# EAGLE design IO bottom board (EAGLE 9.6.2)
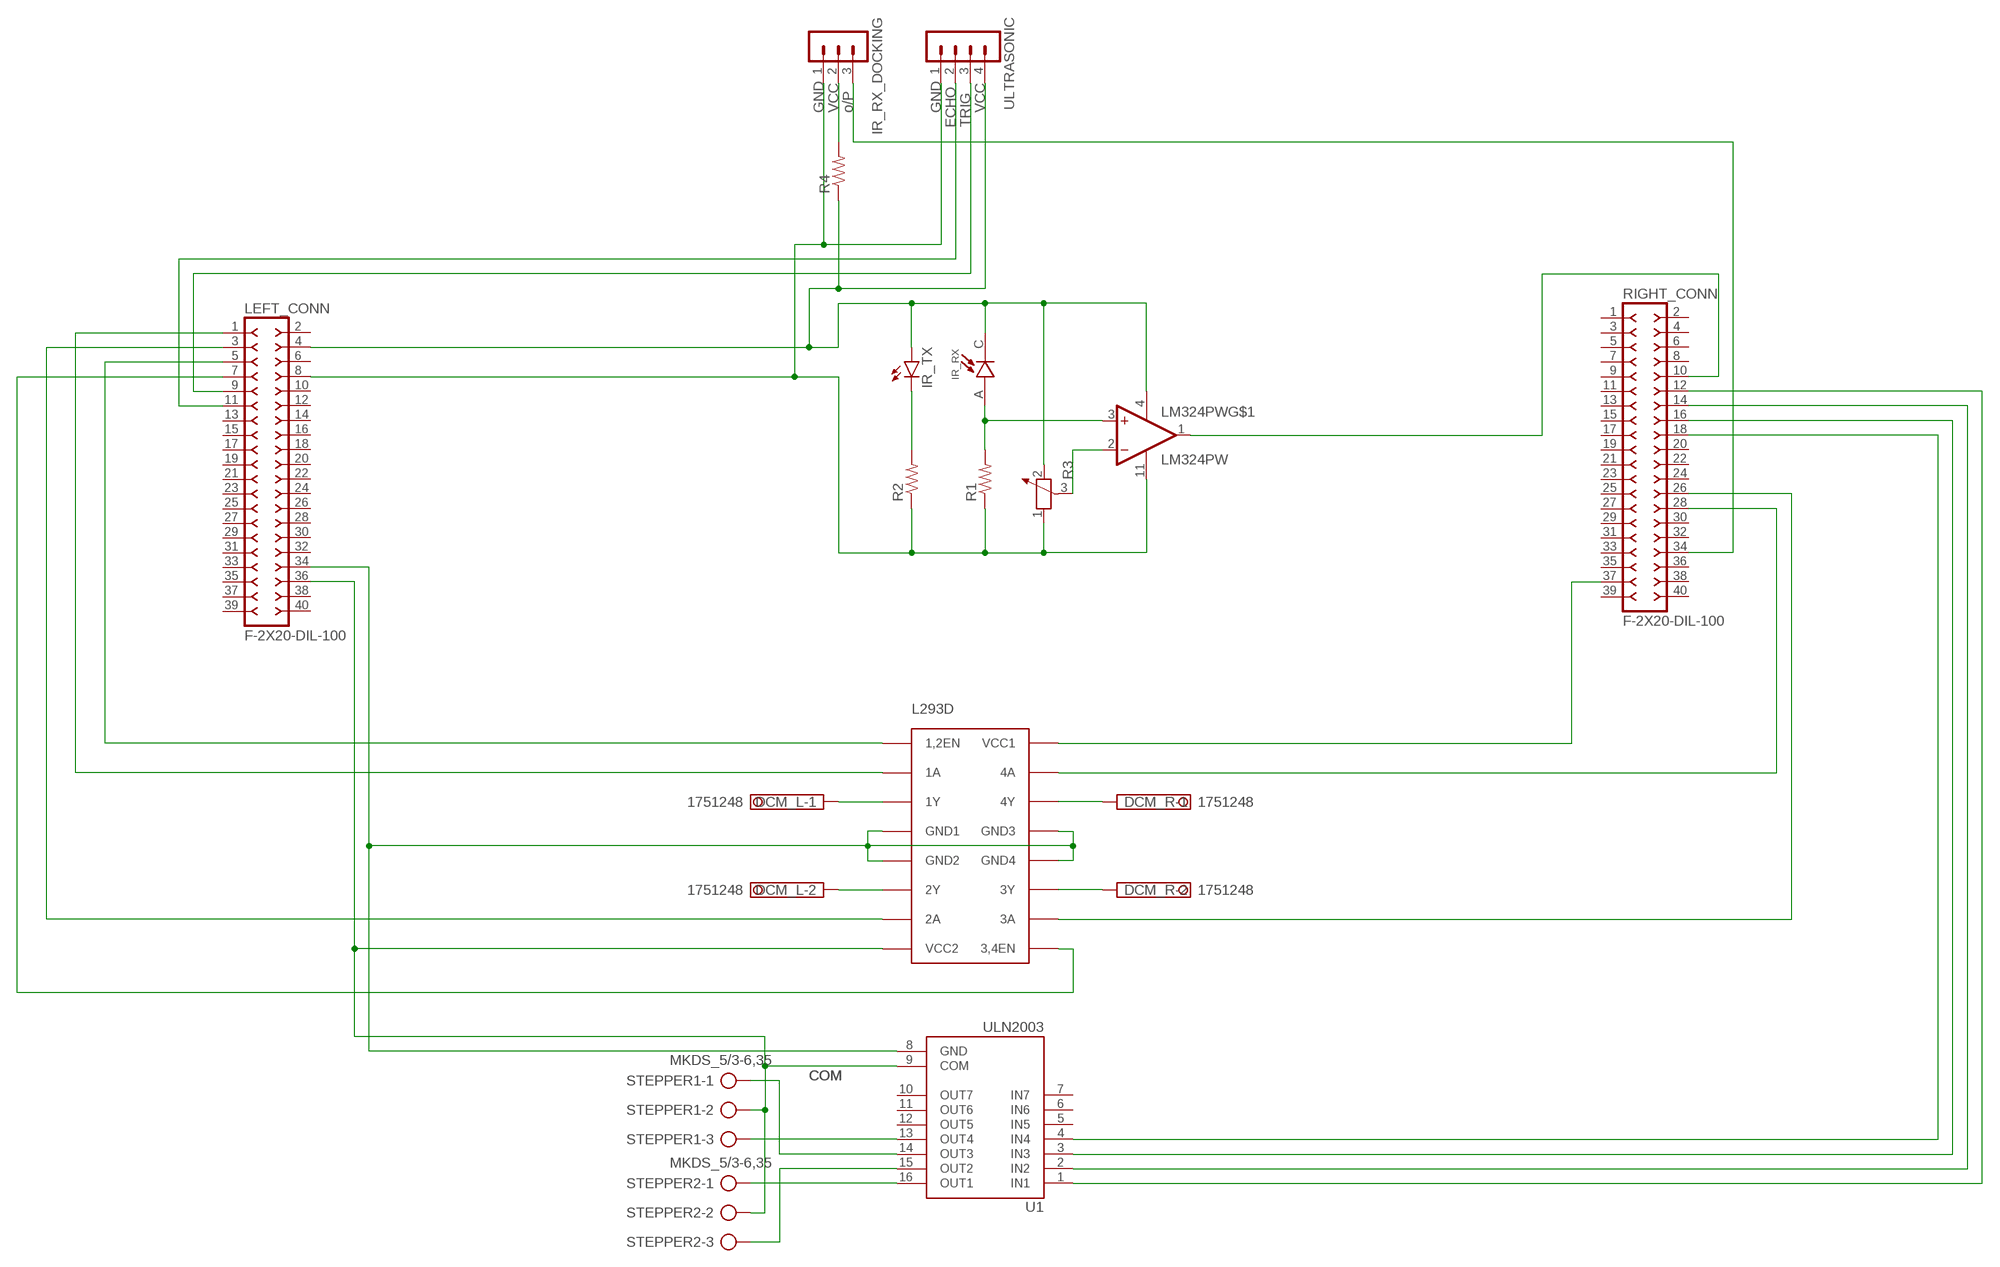
[diagram p0: schematic, sheet 1]

## Parts
DCM_L  1751248  [1751248]
DCM_R  1751248  [1751248]
IR_RX  BPV10  [XDCR_BPV10]
IR_RX_DOCKING  MA03-1  [MA03-1]
IR_TX  SFH482  [SFH482]
L293D  L293D  [DIL16]
LEFT_CONN  F-2X20-DIL-100  [DIL-100-2X20]
LM324PW  LM324PW  [SOP65P640X120-14N]
R1  R-US_0204/5  [0204/5]
R2  R-US_0204/5  [0204/5]
R3  POTENTIOMETER_PT-10  [PT-10]
R4  R-US_0204/5  [0204/5]
RIGHT_CONN  F-2X20-DIL-100  [DIL-100-2X20]
STEPPER1  MKDS_5/3-6,35  [MKDS_5/3-635]
STEPPER2  MKDS_5/3-6,35  [MKDS_5/3-635]
U1  ULN2003  [DIP762W46P254L1969H533Q16]
ULTRASONIC  MA04-1  [MA04-1]

## Nets
N$1: DCM_L.1 L293D.3(1Y)
N$2: DCM_L.2 L293D.6(2Y)
N$3: DCM_R.1 L293D.14(4Y)
N$4: DCM_R.2 L293D.11(3Y)
N$5: LEFT_CONN.11 ULTRASONIC.2
N$6: LEFT_CONN.9 ULTRASONIC.3
N$7: IR_RX_DOCKING.2 R4.2
N$8: L293D.16(VCC1) RIGHT_CONN.37
N$9: RIGHT_CONN.12 U1.1(IN1)
N$10: RIGHT_CONN.14 U1.2(IN2)
N$11: RIGHT_CONN.16 U1.3(IN3)
N$12: RIGHT_CONN.18 U1.4(IN4)
N$13: STEPPER2.1 U1.16(OUT1)
N$14: STEPPER2.3 U1.15(OUT2)
N$15: STEPPER1.1 U1.14(OUT3)
N$16: STEPPER1.3 U1.13(OUT4)
N$17: L293D.8(VCC2) LEFT_CONN.36 STEPPER1.2 STEPPER2.2 U1.9(COM)
N$18: LM324PW.1(OUT1) RIGHT_CONN.10
N$19: L293D.4(GND1) L293D.5(GND2) L293D.12(GND4) L293D.13(GND3) LEFT_CONN.34 U1.8(GND)
N$20: IR_RX.C IR_TX.A LEFT_CONN.4 LM324PW.4(VCC) R3.2 R4.1 ULTRASONIC.4
N$21: IR_TX.K(C) R2.2
N$23: IR_RX.A LM324PW.3(+IN1) R1.2
N$24: LM324PW.2(-IN1) R3.3
N$25: L293D.1(1,2EN) LEFT_CONN.5
N$26: L293D.9(3,4EN) LEFT_CONN.7
N$28: IR_RX_DOCKING.1 LEFT_CONN.8 LM324PW.11(GND) R1.1 R2.1 R3.1 ULTRASONIC.1
N$29: IR_RX_DOCKING.3 RIGHT_CONN.34
N$31: L293D.2(1A) LEFT_CONN.1
N$32: L293D.7(2A) LEFT_CONN.3
N$33: L293D.10(3A) RIGHT_CONN.26
N$34: L293D.15(4A) RIGHT_CONN.28
Unconnected: LEFT_CONN.2 LEFT_CONN.6 LEFT_CONN.10 LEFT_CONN.12 LEFT_CONN.13 LEFT_CONN.14 LEFT_CONN.15 LEFT_CONN.16 LEFT_CONN.17 LEFT_CONN.18 LEFT_CONN.19 LEFT_CONN.20 LEFT_CONN.21 LEFT_CONN.22 LEFT_CONN.23 LEFT_CONN.24 LEFT_CONN.25 LEFT_CONN.26 LEFT_CONN.27 LEFT_CONN.28 LEFT_CONN.29 LEFT_CONN.30 LEFT_CONN.31 LEFT_CONN.32 LEFT_CONN.33 LEFT_CONN.35 LEFT_CONN.37 LEFT_CONN.38 LEFT_CONN.39 LEFT_CONN.40 LM324PW.5(+IN2) LM324PW.6(-IN2) LM324PW.7(OUT2) LM324PW.8(OUT3) LM324PW.9(-IN3) LM324PW.10(+IN3) LM324PW.12(+IN4) LM324PW.13(-IN4) LM324PW.14(OUT4) RIGHT_CONN.1 RIGHT_CONN.2 RIGHT_CONN.3 RIGHT_CONN.4 RIGHT_CONN.5 RIGHT_CONN.6 RIGHT_CONN.7 RIGHT_CONN.8 RIGHT_CONN.9 RIGHT_CONN.11 RIGHT_CONN.13 RIGHT_CONN.15 RIGHT_CONN.17 RIGHT_CONN.19 RIGHT_CONN.20 RIGHT_CONN.21 RIGHT_CONN.22 RIGHT_CONN.23 RIGHT_CONN.24 RIGHT_CONN.25 RIGHT_CONN.27 RIGHT_CONN.29 RIGHT_CONN.30 RIGHT_CONN.31 RIGHT_CONN.32 RIGHT_CONN.33 RIGHT_CONN.35 RIGHT_CONN.36 RIGHT_CONN.38 RIGHT_CONN.39 RIGHT_CONN.40 U1.5(IN5) U1.6(IN6) U1.7(IN7) U1.10(OUT7) U1.11(OUT6) U1.12(OUT5)

## Notes on the sheet
- GND | VCC | o/P | GND | VCC
- ECHO | TRIG
- COM | COM

## Library data of the parts
DCM_L DCM_R = con-phoenix-350:1751248: MKDS 1/ 2-3,5 Printklemme Nennstrom: 10 A Bemessungsspannung: 160 V Raster: 3,5 mm Polzahl: 2 Montageart: Löten Anschlussart: Schraubanschluss Anschlussrichtung vom Leiter zur Platine: 0° Source: http://eshop.phoenixcontact.com .. 1751248.pdf; OC_FARNELL: unknown; OC_NEWARK: unknown
IR_RX = IR Rx BPV10:BPV10: Check prices <https://pricing.snapeda.com/search/part/BPV10/?ref=eda>; AVAILABILITY: Good; DESCRIPTION: Photodiode 940nm 40° Radial; MF: Vishay; MP: BPV10; PACKAGE: Radial Vishay; PRICE: None; PURCHASE-URL: https://pricing.snapeda.com/search/part/BPV10/?ref=eda
IR_RX_DOCKING = con-lstb:MA03-1: PIN HEADER; OC_FARNELL: unknown; OC_NEWARK: unknown
IR_TX = led:SFH482: IR LED infrared emitting diode, Infineon
L293D = L293D 1:L293D
LEFT_CONN RIGHT_CONN = con-headers-jp:F-2X20-: FEMALE HEADER
LM324PW = LM324PW:LM324PW: IC OPAMP LM324/TSSOP/LM324PW TEXAS INSTRUMENT RoHS TSSOP14 Check prices <https://pricing.snapeda.com/search/part/LM324PW/?ref=eda>; AVAILABILITY: Good; DESCRIPTION: 4-Channel industry standard operational amplifier 14-TSSOP 0 to 70; MF: Texas Instruments; MP: LM324PW; PACKAGE: TSSOP-14 Texas Instruments; PRICE: None; PURCHASE-URL: https://pricing.snapeda.com/search/part/LM324PW/?ref=eda
R1 R2 R4 = rcl:R-US_: RESISTOR, American symbol; SPICEPREFIX: R
R3 = rcl:POTENTIOMETER_: Potentiometer; SPICEMODEL: POT; SPICEPREFIX: X
STEPPER1 STEPPER2 = con-phoenix-mkds_5:MKDS_5/3-: MKDS 5/3-6,35 Source: PHOENIX CONTACT; MF: FARNELL; MPN: 1714968; OC_FARNELL: 3704695; OC_NEWARK: 71C4092
U1 = ULN2003:ULN2003: Seven Darlington array Check prices <https://pricing.snapeda.com/search/part/ULN2003/?ref=eda>; AVAILABILITY: Bad; DESCRIPTION: Bipolar (BJT) Transistor Array 7 NPN Darlington 50V 500mA Surface Mount 16-SO; MF: STMicroelectronics; MP: ULN2003; PACKAGE: DIP-16 Toshiba; PRICE: None
ULTRASONIC = con-lstb:MA04-1: PIN HEADER; OC_FARNELL: unknown; OC_NEWARK: unknown

## Board
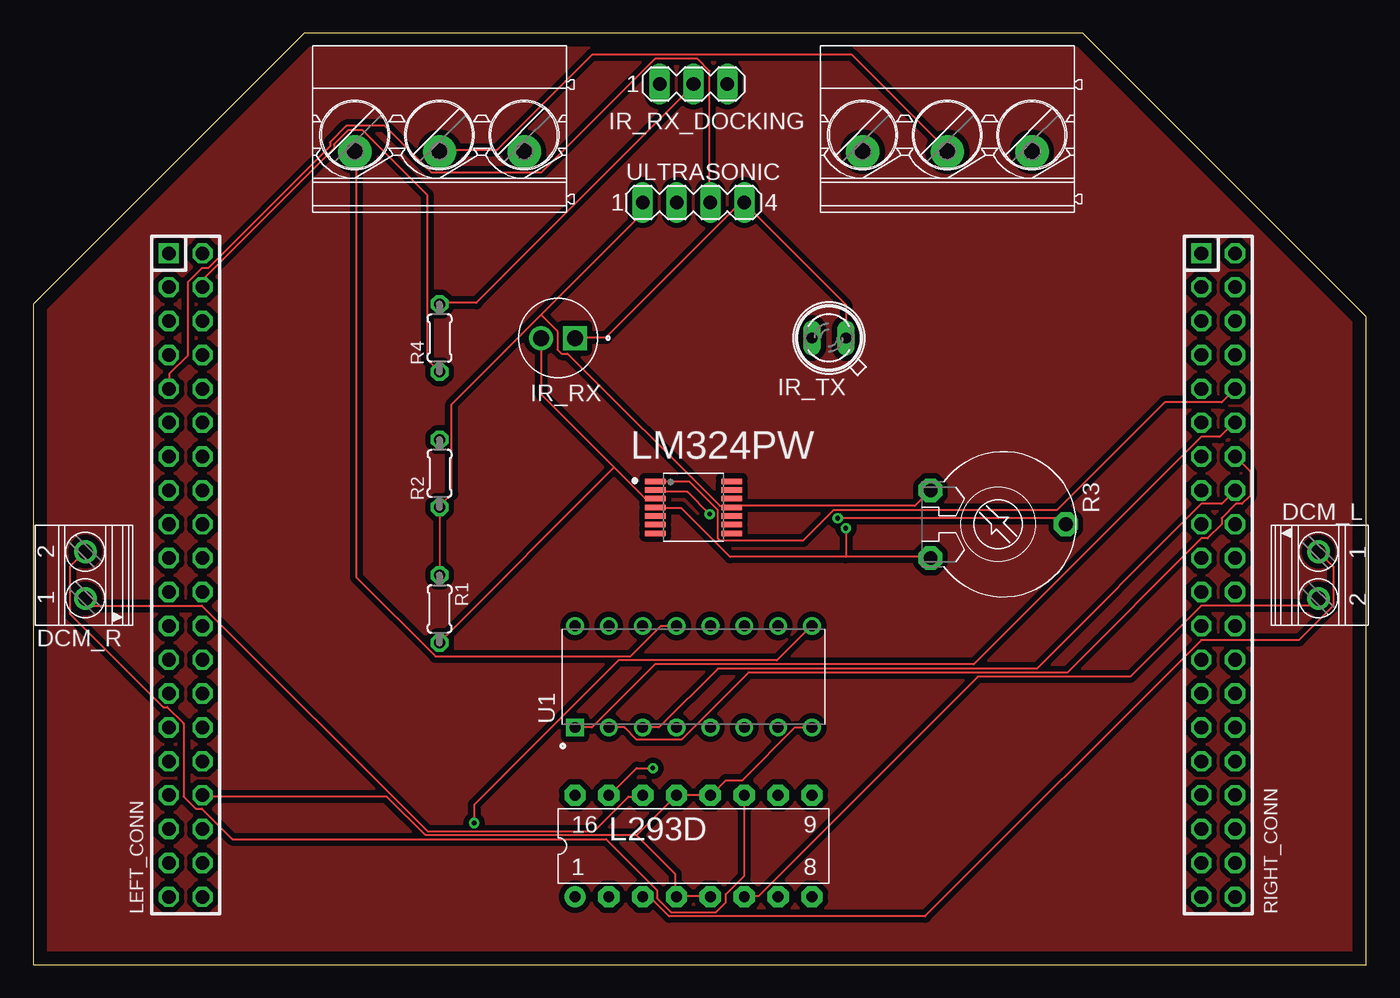
[diagram p1: board, top side]
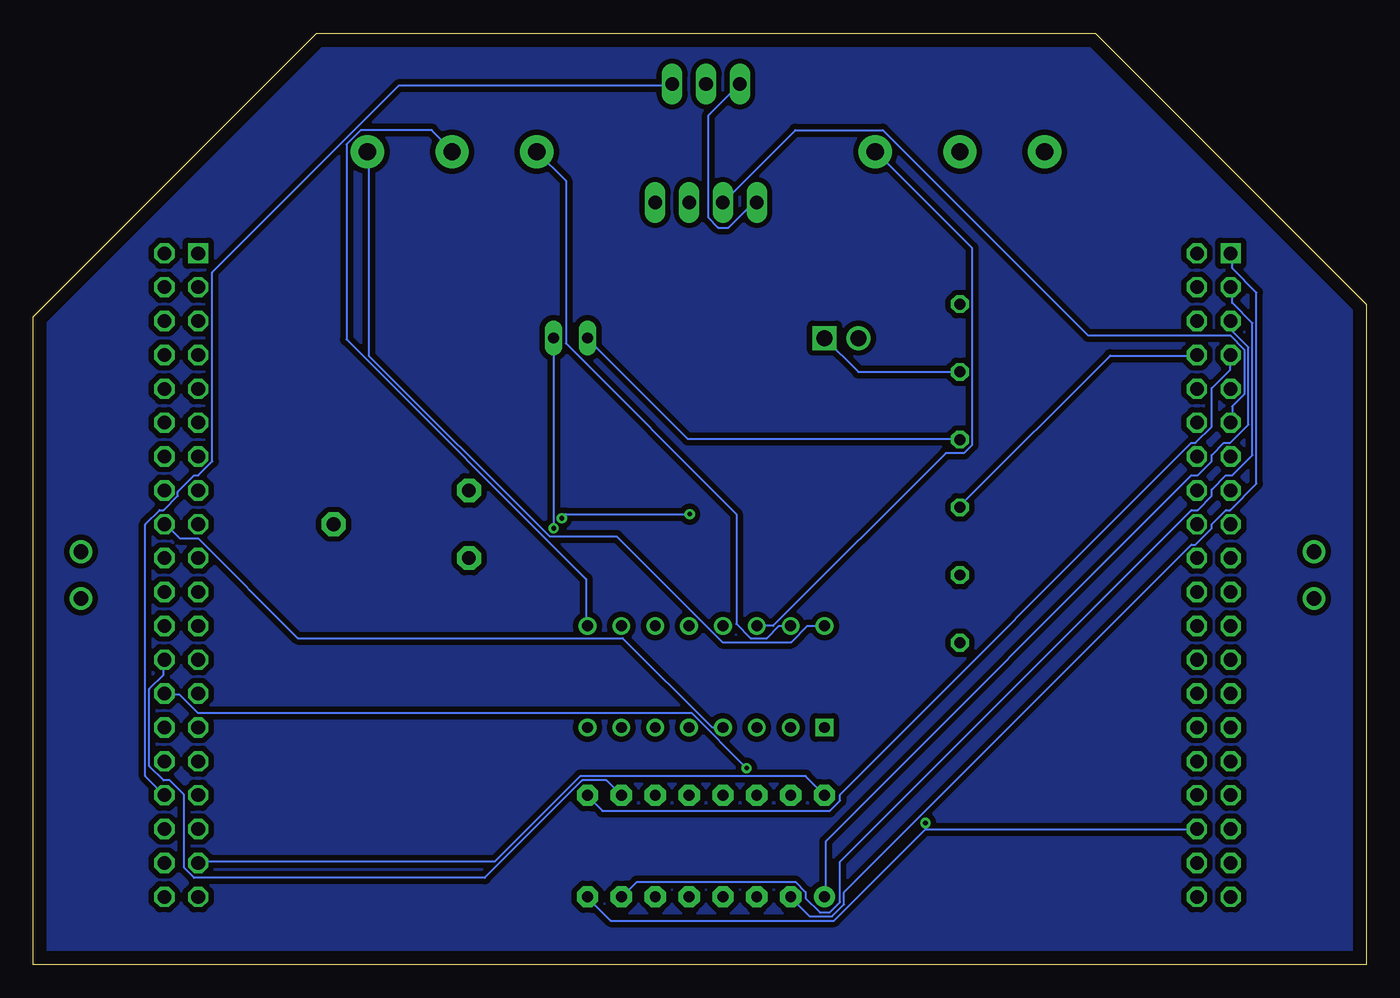
[diagram p2: board, bottom side, seen from below]

Size 100 x 69.84 mm. Coordinates in mm from the lower left corner, seen from the top.
Outline: 0,0 100,0 100,48.59 78.75,69.84 20.31,69.84 0,49.53 0,0
Copper layers (1*16): Top 0.035mm / dielectric 1.5mm / Bottom 0.035mm
Design rules "default": minimum track width 6mil, minimum drill 0.35mm, track to track 6mil, track to pad 6mil, pad to pad 6mil, via to via 6mil, smd to smd 6mil, copper to edge 40mil, drill to drill 6mil, minimum pad ring 10mil, minimum via ring 8mil, stop-mask expansion 4mil, vias tented up to drill 0mil, thermal gap 10mil

### Footprints (pad centres in the part's own frame; a part is rotated, then mirrored left to right if it is on the bottom)
1751248 = drill 1.1 pad 1.7: 1 -1.75,-0.1; 2 1.75,-0.1
XDCR_BPV10 = drill 1.2 pad 1.8: A 1.27,0 | drill 1.2 pad 1.8 square: C -1.27,0
MA03-1 = drill 1.016 long: 1 -2.54,0; 2 0,0; 3 2.54,0
SFH482 = drill 0.813 long: A -1.27,0; K 1.27,0
DIL16 = drill 0.813 pad 1.6: 1 -8.89,-3.81 | drill 0.813 pad 1.6 octagon: 2 -6.35,-3.81; 3 -3.81,-3.81; 4 -1.27,-3.81; 5 1.27,-3.81; 6 3.81,-3.81; 7 6.35,-3.81; 8 8.89,-3.81; 9 8.89,3.81; 10 6.35,3.81; 11 3.81,3.81; 12 1.27,3.81; 13 -1.27,3.81; 14 -3.81,3.81; 15 -6.35,3.81; 16 -8.89,3.81
DIL-100-2X20 = drill 1.016 square: 1 -24.13,-1.27 | drill 1.016 octagon: 2 -24.13,1.27; 3 -21.59,-1.27; 4 -21.59,1.27; 5 -19.05,-1.27; 6 -19.05,1.27; 7 -16.51,-1.27; 8 -16.51,1.27; 9 -13.97,-1.27; 10 -13.97,1.27; 11 -11.43,-1.27; 12 -11.43,1.27; 13 -8.89,-1.27; 14 -8.89,1.27; 15 -6.35,-1.27; 16 -6.35,1.27; 17 -3.81,-1.27; 18 -3.81,1.27; 19 -1.27,-1.27; 20 -1.27,1.27; 21 1.27,-1.27; 22 1.27,1.27; 23 3.81,-1.27; 24 3.81,1.27; 25 6.35,-1.27; 26 6.35,1.27; 27 8.89,-1.27; 28 8.89,1.27; 29 11.43,-1.27; 30 11.43,1.27; 31 13.97,-1.27; 32 13.97,1.27; 33 16.51,-1.27; 34 16.51,1.27; 35 19.05,-1.27; 36 19.05,1.27; 37 21.59,-1.27; 38 21.59,1.27; 39 24.13,-1.27; 40 24.13,1.27
SOP65P640X120-14N = smd 1.57 x 0.41: 1 -2.87,1.95; 2 -2.87,1.3; 3 -2.87,0.65; 4 -2.87,0; 5 -2.87,-0.65; 6 -2.87,-1.3; 7 -2.87,-1.95; 8 2.87,-1.95; 9 2.87,-1.3; 10 2.87,-0.65; 11 2.87,0; 12 2.87,0.65; 13 2.87,1.3; 14 2.87,1.95
0204/5 = drill 0.813 octagon: 1 -2.54,0; 2 2.54,0
PT-10 = drill 1.016 pad 1.778 octagon: 1 -2.54,-5.08; 2 2.54,-5.08; 3 0,5.08
MKDS_5/3-635 = drill 1.3 pad 2.5: 1 -6.35,0; 2 0,0; 3 6.35,0
DIP762W46P254L1969H533Q16 = drill 0.82 square: 1 -3.81,8.89 | drill 0.82: 2 -3.81,6.35; 3 -3.81,3.81; 4 -3.81,1.27; 5 -3.81,-1.27; 6 -3.81,-3.81; 7 -3.81,-6.35; 8 -3.81,-8.89; 9 3.81,-8.89; 10 3.81,-6.35; 11 3.81,-3.81; 12 3.81,-1.27; 13 3.81,1.27; 14 3.81,3.81; 15 3.81,6.35; 16 3.81,8.89
MA04-1 = drill 1.016 long: 1 -3.81,0; 2 -1.27,0; 3 1.27,0; 4 3.81,0

### Placement (x,y rotation side)
DCM_L  96.52,29.21 270 top
DCM_R  3.81,29.21 90 top
IR_RX  39.37,46.99 180 top
IR_RX_DOCKING  49.53,66.04 0 top
IR_TX  59.69,46.99 180 top
L293D  49.53,8.89 0 top
LEFT_CONN  11.43,29.21 270 top
LM324PW  49.53,34.29 0 top
R1  30.48,26.67 270 top
R2  30.48,36.83 90 top
R3  72.39,33.02 270 top
R4  30.48,46.99 90 top
RIGHT_CONN  88.9,29.21 270 top
STEPPER1  30.48,60.96 180 top
STEPPER2  68.58,60.96 180 top
U1  49.53,21.59 90 top
ULTRASONIC  49.53,57.15 0 top

### Tracks (layer width: path | path; a pad name or v marks a point on that pad's centre or on a via)
GND
  pour Top (isolate 0.406): 20.32,69.85 78.74,69.85 100.33,48.26 100.33,0 0,0 0,49.53
  pour Bottom (isolate 0.406): 20.32,69.85 78.74,69.85 100.33,48.26 100.33,0 0,0 0,49.53
N$1
  Top 0.152: L293D.3 45.72,4.98 46.33,4.98 47.7,3.61 66.9,3.61 87.63,24.33 94.94,24.33 97.54,26.92 97.54,29.82 96.47,30.89 DCM_L.1
N$2
  Top 0.152: L293D.6 53.34,5.13 54.41,5.13 70.87,21.59 82.3,21.59 87.63,26.92 95.86,26.92 96.32,27.38 DCM_L.2
N$3
  Top 0.152: L293D.14 45.72,12.6 44.65,12.6 42.06,10.01 29.57,10.01 12.65,26.92 4.42,26.92 3.96,27.38 DCM_R.1
N$4
  Top 0.152: L293D.11 53.34,6.65 51.97,5.28 51.97,4.67 51.21,3.91 47.85,3.91 46.79,4.98 46.79,5.59 42.98,9.4 14.94,9.4 12.65,11.68 12.19,11.68 11.28,12.6 11.28,18.09 10.06,19.3 9.75,19.3 2.74,26.31 2.74,29.82 3.81,30.89 DCM_R.2
N$5
  Bottom 0.152: ULTRASONIC.2 42.82,62.59 36.27,62.59 20.88,47.19 10.21,47.19 9.14,46.13 9.14,42.77 10.06,41.86 10.06,40.64 LEFT_CONN.11
N$6
  Top 0.152: LEFT_CONN.9 10.21,43.23 10.21,44.3 11.58,45.67 11.58,51.16 12.65,52.22 13.11,52.22 22.25,61.37 22.25,61.67 23.47,62.89 26.36,62.89 29.87,59.39 38.1,59.39 46.63,67.92 49.84,67.92 50.75,67 50.75,57.25 ULTRASONIC.3
N$7
  Top 0.152: R4.2 30.48,49.63 33.22,49.63 49.53,65.94 IR_RX_DOCKING.2
N$8
  Bottom 0.152: L293D.16 42.06,14.12 58.98,14.12 65.38,7.72 87.63,7.72 RIGHT_CONN.37
N$9
  Top 0.152: U1.1 41.91,17.78 46.63,22.5 70.56,22.5 87.63,39.57 89,39.57 90.07,40.64 RIGHT_CONN.12
N$10
  Top 0.152: U1.2 44.35,17.78 45.26,16.87 48.62,16.87 53.65,21.9 77.57,21.9 87.63,31.95 88.09,31.95 89.15,33.02 89.15,33.48 90.22,34.54 90.68,34.54 91.29,35.15 91.29,36.98 RIGHT_CONN.14
N$11
  Top 0.152: U1.3 46.94,17.78 51.36,22.2 75.29,22.2 87.63,34.54 89.15,34.54 RIGHT_CONN.16
N$12
  Bottom 0.152: U1.4 49.07,17.78 55.78,24.49 80.16,24.49 87.63,31.95 89,31.95 90.07,33.02 RIGHT_CONN.18
N$13
  Bottom 0.152: U1.16 41.91,25.4 43.13,24.18 48.31,24.18 56.24,32.11 61.27,32.11 74.83,45.67 74.83,60.91 STEPPER2.1
N$14
  Bottom 0.152: U1.15 44.04,25.4 44.96,24.49 46.18,24.49 47.24,25.55 47.24,33.78 60.05,46.58 60.05,58.78 STEPPER2.3
N$15
  Bottom 0.152: U1.14 44.5,25.4 31.55,38.35 30.18,38.35 29.57,38.96 29.57,53.75 36.73,60.91 STEPPER1.1
N$16
  Top 0.152: U1.13 47.09,25.4 44.81,23.11 30.18,23.11 24.23,29.06 24.23,60.91 STEPPER1.3
N$17  (via drill 0.35)
  Top 0.152: STEPPER1.2 30.48,61.06 34.75,61.06 41.91,68.22 61.42,68.22 68.58,61.06 STEPPER2.2 | v33.07,10.62 33.07,11.99 43.89,22.81 55.78,22.81 58.37,25.4 U1.9
  Bottom 0.152: 33.07,10.16 LEFT_CONN.36 | 33.07,10.16 39.93,3.3 56.69,3.3 58.37,4.98 L293D.8 | U1.9 58.52,25.4 58.52,28.91 76.5,46.89 76.5,61.52 75.44,62.59 70.1,62.59 68.58,61.06 STEPPER2.2 | v33.07,10.62 33.07,10.16
N$18
  Top 0.152: RIGHT_CONN.10 89.15,42.16 84.89,42.16 76.81,34.09 60.05,34.09 57.76,31.8 51.51,31.8 51.36,31.95 51.36,34.09 49.23,36.22 46.79,36.22 LM324PW.1
N$19
  Top 0.152: U1.8 57.15,17.78 53.19,13.82 51.97,13.82 50.9,12.75 L293D.12 50.75,12.75 48.31,12.75 L293D.13 45.26,9.7 | L293D.5 50.75,5.13 48.31,5.13 L293D.4 48.16,5.13 48.16,6.81 45.26,9.7 | 45.26,9.7 29.41,9.7 26.52,12.6 12.8,12.6 LEFT_CONN.34
N$20  (via drill 0.35)
  Top 0.152: 60.96,30.58 67.21,30.58 R3.2 | 60.96,30.58 52.27,30.58 48.62,34.24 46.79,34.24 LM324PW.4 | IR_TX.A 60.96,49.48 53.34,57.1 | R4.1 29.57,45.36 29.57,57.71 24.69,62.59 23.62,62.59 22.55,61.52 22.55,61.21 12.8,51.46 12.8,50.85 LEFT_CONN.4 | 53.34,57.1 53.03,57.1 42.98,47.04 40.69,47.04 IR_RX.C | 53.34,57.1 ULTRASONIC.4 | v60.96,32.72 60.96,30.58
  Bottom 0.152: R4.1 38.1,44.45 IR_RX.C | IR_TX.A v60.96,32.72
N$21
  Bottom 0.152: R2.2 30.48,39.42 50.9,39.42 58.37,46.89 IR_TX.K
N$23
  Top 0.152: 43.59,37.29 38.1,42.77 IR_RX.A | 43.59,37.29 45.87,35 46.63,35 LM324PW.3 | 43.59,37.29 30.48,24.18 R1.2
N$24  (via drill 0.35)
  Top 0.152: v50.75,33.78 49.07,35.46 46.79,35.46 LM324PW.2 | v60.35,33.48 76.96,33.48 77.42,33.02 R3.3
  Bottom 0.152: v50.75,33.78 60.05,33.78 v60.35,33.48
N$25
  Bottom 0.152: LEFT_CONN.5 10.06,48.26 10.06,47.5 8.84,46.28 8.84,40.49 10.21,39.12 10.67,39.12 11.58,38.2 11.58,37.74 12.65,36.68 13.11,36.68 40.54,9.25 40.54,5.13 L293D.1
N$26
  Bottom 0.152: LEFT_CONN.7 10.21,45.67 10.21,44.6 11.58,43.23 11.58,40.34 12.8,39.12 13.11,39.12 39.47,12.75 39.47,12.29 40.23,11.53 57.3,11.53 58.37,12.6 L293D.9
N$28
  Top 0.152: R3.1 66.14,34.39 52.43,34.39 LM324PW.11 52.27,34.39 51.51,34.39 40.08,45.82 39.62,45.82 39.32,46.13 39.32,47.5 38.1,48.72 | R1.1 R2.1 30.48,34.39 31.39,35.31 31.39,42.01 38.1,48.72 | ULTRASONIC.1 45.72,56.34 38.1,48.72
  Bottom 0.152: IR_RX_DOCKING.1 49.38,63.65 49.38,56.03 48.62,55.27 47.85,55.27 46.02,57.1 45.72,57.1 ULTRASONIC.1 | LEFT_CONN.8 12.8,45.67 19.2,45.67 30.48,34.39 R2.1
N$29
  Bottom 0.152: RIGHT_CONN.34 91.59,14.12 91.59,33.02 90.53,34.09 90.22,34.09 89.15,35.15 89.15,35.46 87.94,36.68 87.63,36.68 86.56,37.74 86.56,51.92 72.54,65.94 52.12,65.94 IR_RX_DOCKING.3
N$31
  Bottom 0.152: LEFT_CONN.1 10.06,53.29 10.06,52.22 8.23,50.39 8.23,36.07 10.21,34.09 10.52,34.09 11.58,33.02 11.58,32.72 12.8,31.5 13.11,31.5 39.17,5.44 39.17,4.52 40.08,3.61 41.76,3.61 43.13,4.98 L293D.2
N$32
  Bottom 0.152: LEFT_CONN.3 10.06,50.7 10.06,49.63 8.53,48.11 8.53,38.2 10.06,36.68 10.52,36.68 11.58,35.61 11.58,35.15 12.65,34.09 13.11,34.09 39.47,7.72 39.47,4.67 40.23,3.91 41,3.91 42.06,4.98 42.06,5.44 42.82,6.2 54.71,6.2 55.78,5.13 L293D.7
N$33
  Bottom 0.152: L293D.10 57,13.82 58.83,13.82 66.14,6.5 87.94,6.5 88.7,7.26 88.7,12.75 89.76,13.82 90.22,13.82 91.29,14.88 91.29,20.68 90.22,21.74 90.22,22.81 RIGHT_CONN.26
N$34  (via drill 0.35)
  Top 0.152: v46.48,14.73 45.26,14.73 43.28,12.75 L293D.15
  Bottom 0.152: v46.48,14.73 50.6,18.85 87.63,18.85 89,20.22 90.07,20.22 RIGHT_CONN.28

### Text on the board
Document: IO BOTTOM BOARD